# EAGLE schematic scoreboard_b2_v3 (EAGLE 9.0.1)
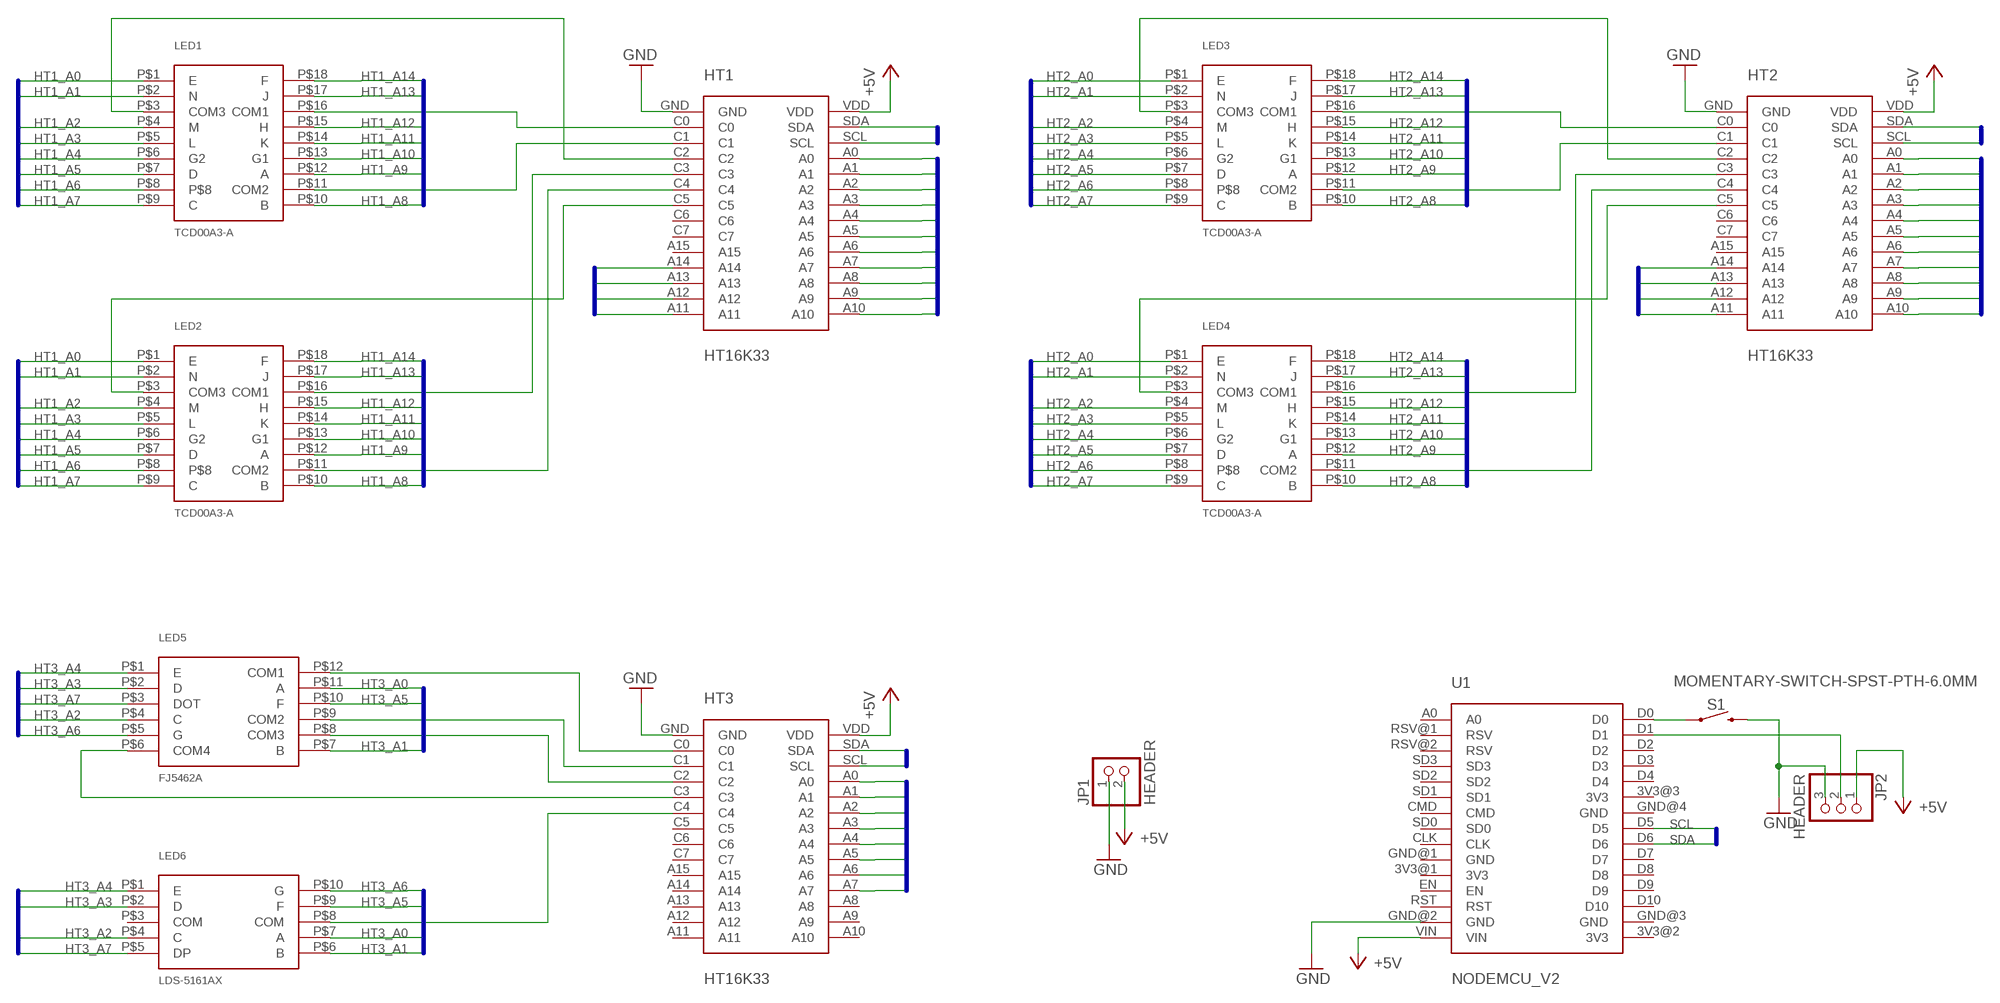
[diagram p0: schematic, sheet 1]

## Parts
HT1  HT16K33  [HT16K33]
HT2  HT16K33  [HT16K33]
HT3  HT16K33  [HT16K33]
JP1  HEADER  PINHD-1X2  [1X02]
JP2  HEADER  PINHD-1X3  [1X03]
LED1  TCD00A3-A  [TCD00A3-A]
LED2  TCD00A3-A  [TCD00A3-A]
LED3  TCD00A3-A  [TCD00A3-A]
LED4  TCD00A3-A  [TCD00A3-A]
LED5  FJ5462A  [FJ5462A]
LED6  LDS-5161AX  [LDS-5161AX]
S1  MOMENTARY-SWITCH-SPST-PTH-6.0MM  [TACTILE_SWITCH_PTH_6.0MM]
U1  NODEMCU_V2  [NODEMCU_V2]

## Nets
+5V [thick]: HT1.VDD HT2.VDD HT3.VDD JP1.2 JP2.1 U1.VIN
BUZ: JP2.2 U1.D1
GND [thick]: HT1.GND HT2.GND HT3.GND JP1.1 JP2.3 S1.3 U1.GND@2(GND)
HT1_A0: HT1.A0 LED1.P$1(E) LED2.P$1(E)
HT1_A1: HT1.A1 LED1.P$2(N) LED2.P$2(N)
HT1_A2: HT1.A2 LED1.P$4(M) LED2.P$4(M)
HT1_A3: HT1.A3 LED1.P$5(L) LED2.P$5(L)
HT1_A4: HT1.A4 LED1.P$6(G2) LED2.P$6(G2)
HT1_A5: HT1.A5 LED1.P$7(D) LED2.P$7(D)
HT1_A6: HT1.A6 LED1.P$8 LED2.P$8
HT1_A7: HT1.A7 LED1.P$9(C) LED2.P$9(C)
HT1_A8: HT1.A8 LED1.P$10(B) LED2.P$10(B)
HT1_A9: HT1.A9 LED1.P$12(A) LED2.P$12(A)
HT1_A10: HT1.A10 LED1.P$13(G1) LED2.P$13(G1)
HT1_A11: HT1.A11 LED1.P$14(K) LED2.P$14(K)
HT1_A12: HT1.A12 LED1.P$15(H) LED2.P$15(H)
HT1_A13: HT1.A13 LED1.P$17(J) LED2.P$17(J)
HT1_A14: HT1.A14 LED1.P$18(F) LED2.P$18(F)
HT1_C0: HT1.C0 LED1.P$16(COM1)
HT1_C1: HT1.C1 LED1.P$11(COM2)
HT1_C2: HT1.C2 LED1.P$3(COM3)
HT1_C3: HT1.C3 LED2.P$16(COM1)
HT1_C4: HT1.C4 LED2.P$11(COM2)
HT1_C5: HT1.C5 LED2.P$3(COM3)
HT2_A0: HT2.A0 LED3.P$1(E) LED4.P$1(E)
HT2_A1: HT2.A1 LED3.P$2(N) LED4.P$2(N)
HT2_A2: HT2.A2 LED3.P$4(M) LED4.P$4(M)
HT2_A3: HT2.A3 LED3.P$5(L) LED4.P$5(L)
HT2_A4: HT2.A4 LED3.P$6(G2) LED4.P$6(G2)
HT2_A5: HT2.A5 LED3.P$7(D) LED4.P$7(D)
HT2_A6: HT2.A6 LED3.P$8 LED4.P$8
HT2_A7: HT2.A7 LED3.P$9(C) LED4.P$9(C)
HT2_A8: HT2.A8 LED3.P$10(B) LED4.P$10(B)
HT2_A9: HT2.A9 LED3.P$12(A) LED4.P$12(A)
HT2_A10: HT2.A10 LED3.P$13(G1) LED4.P$13(G1)
HT2_A11: HT2.A11 LED3.P$14(K) LED4.P$14(K)
HT2_A12: HT2.A12 LED3.P$15(H) LED4.P$15(H)
HT2_A13: HT2.A13 LED3.P$17(J) LED4.P$17(J)
HT2_A14: HT2.A14 LED3.P$18(F) LED4.P$18(F)
HT2_C0: HT2.C0 LED3.P$16(COM1)
HT2_C1: HT2.C1 LED3.P$11(COM2)
HT2_C2: HT2.C2 LED3.P$3(COM3)
HT2_C3: HT2.C3 LED4.P$16(COM1)
HT2_C4: HT2.C4 LED4.P$11(COM2)
HT2_C5: HT2.C5 LED4.P$3(COM3)
HT3_A0: HT3.A0 LED5.P$11(A) LED6.P$7(A)
HT3_A1: HT3.A1 LED5.P$7(B) LED6.P$6(B)
HT3_A2: HT3.A2 LED5.P$4(C) LED6.P$4(C)
HT3_A3: HT3.A3 LED5.P$2(D) LED6.P$2(D)
HT3_A4: HT3.A4 LED5.P$1(E) LED6.P$1(E)
HT3_A5: HT3.A5 LED5.P$10(F) LED6.P$9(F)
HT3_A6: HT3.A6 LED5.P$5(G) LED6.P$10(G)
HT3_A7: HT3.A7 LED5.P$3(DOT) LED6.P$5(DP)
HT3_C0: HT3.C0 LED5.P$12(COM1)
HT3_C1: HT3.C1 LED5.P$9(COM2)
HT3_C2: HT3.C2 LED5.P$8(COM3)
HT3_C3: HT3.C3 LED5.P$6(COM4)
HT3_C4: HT3.C4 LED6.P$8(COM)
SCL: HT1.SCL HT2.SCL HT3.SCL U1.D5
SDA: HT1.SDA HT2.SDA HT3.SDA U1.D6
SW: S1.1 U1.D0
Unconnected: HT1.A15 HT1.C6 HT1.C7 HT2.A15 HT2.C6 HT2.C7 HT3.A8 HT3.A9 HT3.A10 HT3.A11 HT3.A12 HT3.A13 HT3.A14 HT3.A15 HT3.C5 HT3.C6 HT3.C7 LED6.P$3(COM) U1.3V3@1(3V3) U1.3V3@2(3V3) U1.3V3@3(3V3) U1.A0 U1.CLK U1.CMD U1.D2 U1.D3 U1.D4 U1.D7 U1.D8 U1.D9 U1.D10 U1.EN U1.GND@1(GND) U1.GND@3(GND) U1.GND@4(GND) U1.RST U1.RSV@1(RSV) U1.RSV@2(RSV) U1.SD0 U1.SD1 U1.SD2 U1.SD3

## Buses
HT1A:HT1_A[0..7]
HT1B:HT1_A[8..14]
HT1_A[11..14]
HT1_A[0..10]
HT2B:HT2_A[8..14]
HT2_A[11..14]
HT2A:HT2_A[0..7]
HT2_A[0..10]
HT3:HT3_A[0..7]
I2C:SCL,SDA

## Library data of the parts
HT1-HT3 = ScoreBoard:HT16K33: I2C LED Matrix Driver
JP1 = pinhead:PINHD-1X2: PIN HEADER
JP2 = pinhead:PINHD-1X3: PIN HEADER
LED1-LED4 = ScoreBoard:TCD00A3-A: 14 Segment LED Display 3 Digits
LED5 = ScoreBoard:FJ5462A: 4 Digits (Clock) 7 Segment LED Display
LED6 = ScoreBoard:LDS-5161AX: 1 Digit 7 Segment LED Display
S1 = SparkFun-Switches:MOMENTARY-SWITCH-SPST: Momentary Switch (Pushbutton) - SPST Normally-open (NO) SPST momentary switches (buttons, pushbuttons). Variants PTH-12MM - 12mm square, through-hole Momentary Pushbutton Switch - 12mm Square <https://www.sparkfun.com/products/9190> (COM-09190) PTH-6.0MM, PTH-6.0MM-KIT - 6.0mm square, through-hole Mini Pushbutton Switch <https://www.sparkfun.com/products/97> (COM-00097) KIT package intended for soldering kit's - only one side of pads' copper is exposed. PTH-RIGHT-ANGLE-KIT - Right-angle, through-hole Right Angle Tactile Button <https://www.sparkfun.com/products/10791> - Used on SparkFun BigTime Watch Kit <https://www.sparkfun.com/products/11734> SMD-12MM - 12mm square, surface-mount Tactile Button - SMD (12mm) <https://www.sparkfun.com/products/12993> (COM-12993) Used on SparkFun PicoBoard <https://www.sparkfun.com/products/11888> SMD-4.5MM - 4.5mm Square Trackball Switch Used on SparkFun Blackberry Trackballer Breakout <https://www.sparkfun.com/products/13169> SMD-4.6MMX2.8MM - 4.60mm x 2.80mm, surface mount Used on SparkFun SAMD21 Mini Breakout <https://www.sparkfun.com/products/13664> SMD-5.2MM, SMD-5.2-REDUNDANT - 5.2mm square, surface-mount Mini Pushbutton Switch - SMD <https://www.sparkfun.com/products/8720> (COM-08720) Used on Arduino Pro Mini <https://www.sparkfun.com/products/11114> REDUNDANT package connects both switch circuits together SMD-6.0X3.5MM - 6.0 x 3.5mm, surface mount Momentary Reset Switch SMD <https://www.sparkfun.com/products/8229> (COM-08229) SMD-6.2MM-TALL - 6.2mm square, surface mount Tactile Button - SMD (6mm) <https://www.sparkfun.com/products/12992> Used on SparkFun Digital Sandbox <https://www.sparkfun.com/products/12651> SMD-RIGHT-ANGLE - Right-angle, surface mount Used on SparkFun Block for Intel® Edison - Arduino <https://www.sparkfun.com/products/13036>; PROD_ID: SWCH-08441; SF_SKU: COM-00097
U1 = ScoreBoard:NODEMCU_V2: ESP8266 Module Dev Board

## Net classes
1 thick: width 0.381 mm, drill 0.254 mm, clearance 0.254 mm to class 0, clearance 0.254 mm